# Altium schematic sheet LTC2949_Connectors.SchDoc
size A4; SheetNumber: 3; SheetTotal: 3
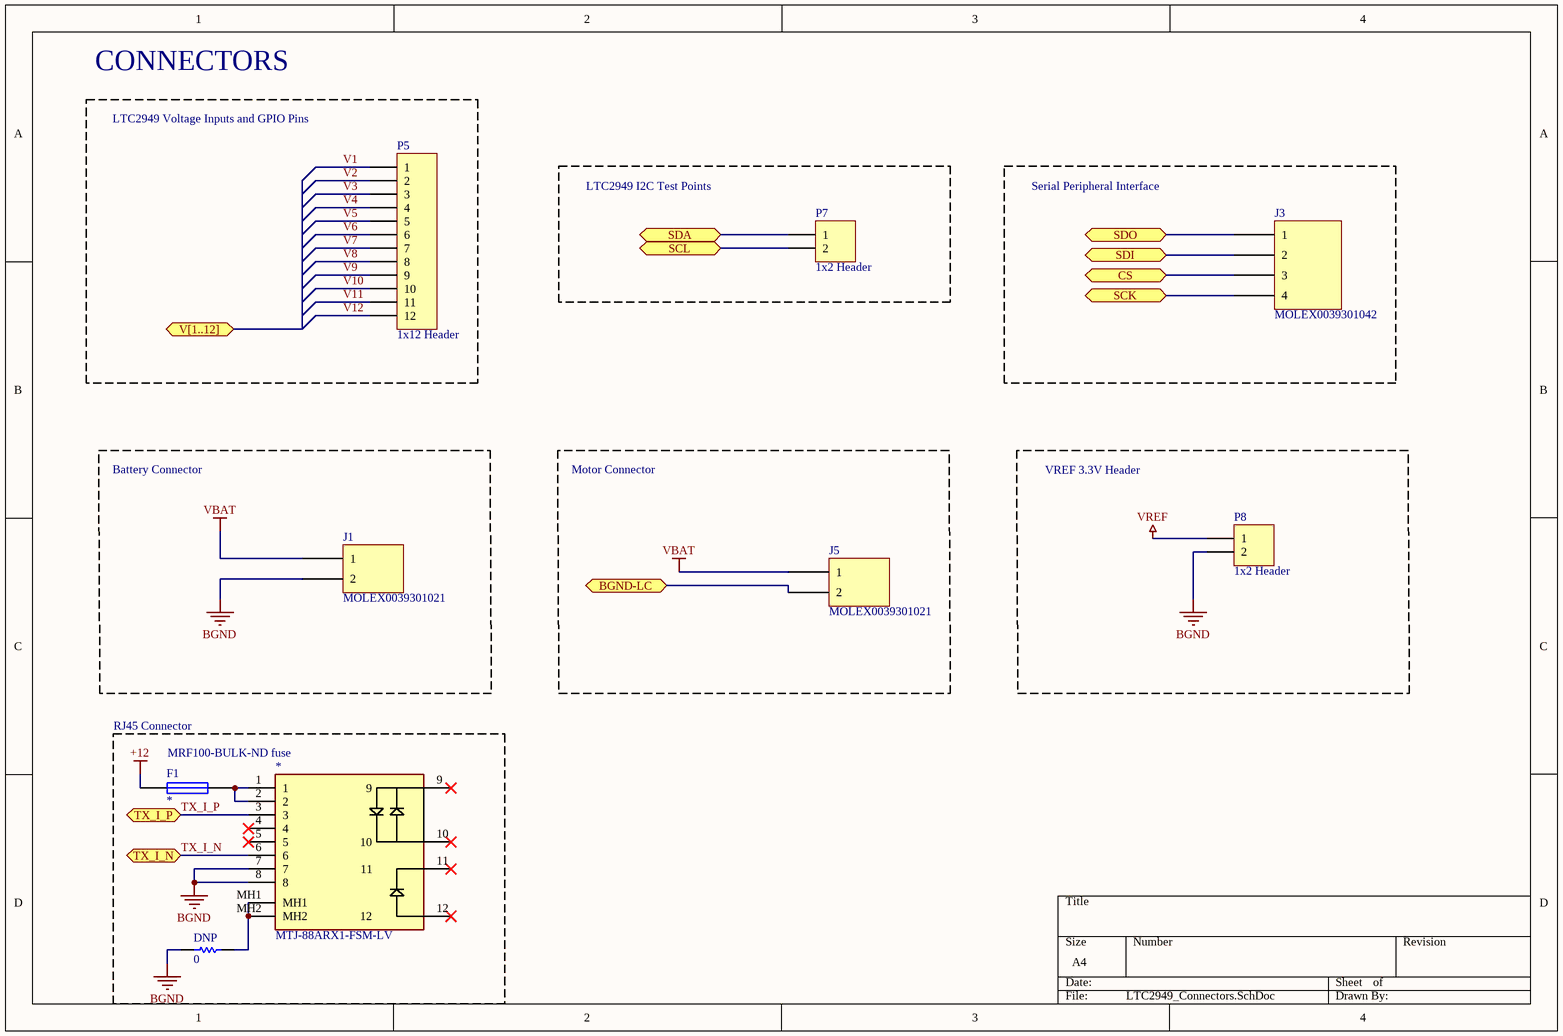
[diagram p0: LTC2949_Connectors.SchDoc]

## Parts
*  MTJ-88ARX1-FSM-LV  [MTJ-88ARX1-FSM-LV]
DNP  value 0  [0603 - Resistor]  (hidden comment: Resistor)
F1  Fuse  [3557-2]  (value not drawn)
J1  MOLEX0039301021  [MOLEX0039301021]
J3  MOLEX0039301042  [MOLEX0039301042]
J5  MOLEX0039301021  [MOLEX0039301021]
P5  1x12 Header  [HDR1X12]
P7  1x2 Header  [HDR1X2]
P8  1x2 Header  [HDR1X2]

## Blocks framed on the sheet
LTC2949 Voltage Inputs and GPIO Pins: P5
LTC2949 I2C Test Points: P7
Serial Peripheral Interface: J3
Battery Connector: J1
Motor Connector: J5

## Ports
BGND-LC (bidir), CS (bidir), SCK (bidir), SCL (bidir), SDA (bidir), SDI (bidir), SDO (bidir), TX_I_N (bidir), TX_I_P (bidir), V[1..12] (bidir)

## Nets
+12: F1.1
BGND: *.7 *.8 DNP.1 J1.2 P8.2
VBAT: J1.1 J5.1
VREF: P8.1
BGND-LC: J5.2 ; port BGND-LC
CS: J3.3 ; port CS
SCK: J3.4 ; port SCK
SCL: P7.2 ; port SCL
SDA: P7.1 ; port SDA
SDI: J3.2 ; port SDI
SDO: J3.1 ; port SDO
TX_I_N: *.6 ; port TX_I_N
TX_I_P: *.3 ; port TX_I_P
V1: P5.1
V2: P5.2
V3: P5.3
V4: P5.4
V5: P5.5
V6: P5.6
V7: P5.7
V8: P5.8
V9: P5.9
V10: P5.10
V11: P5.11
V12: P5.12
Net*_1: *.1 *.2 F1.2
Net*_MH1: *.MH1 *.MH2 DNP.2

Not connected (* = marked no-connect by the designer): * 4* 5* 9* 10* 11* 12*

## Notes on the sheet
- CONNECTORS
- VREF 3.3V Header
- RJ45 Connector
- MRF100-BULK-ND fuse

## Library data of the parts
* = MTJ-88ARX1-FSM-LV: RJ45 Connector
J1 J5 = MOLEX0039301021: Connector Header Through Hole, Right Angle 2 pin 0.165" (4.20mm)
J3 = MOLEX0039301042: Connector Header Through Hole, Right Angle 4 position 0.165" (4.20mm); Manufacturer: Molex; Manufacturer Part Number: 0039301042; Supplier: Digikey; Supplier Part Number: WM21364-ND; ComponentLink1Description: Datasheet; ComponentLink1URL: https://www.molex.com/pdm_docs/sd/039301042_sd.pdf
P5 = 1x12 Header: 1x12 Pin Header
P7 P8 = 1x2 Header: 1x2 Pin Header
DNP = Resistor: Rating: *; Manufacturer Part Number: *; Manufacturer: *; Supplier Part Number: *; Supplier: *
F1 = Fuse: Rating: *; Supplier Part Number: *; Supplier: *; Manufacturer: *; Manufacturer Part Number: *; Value: *